# Altium schematic sheet 11.RK3588_MIPI_D_C_PHY0_1.SchDoc
size A3; SheetNumber: 11; SheetTotal: 21
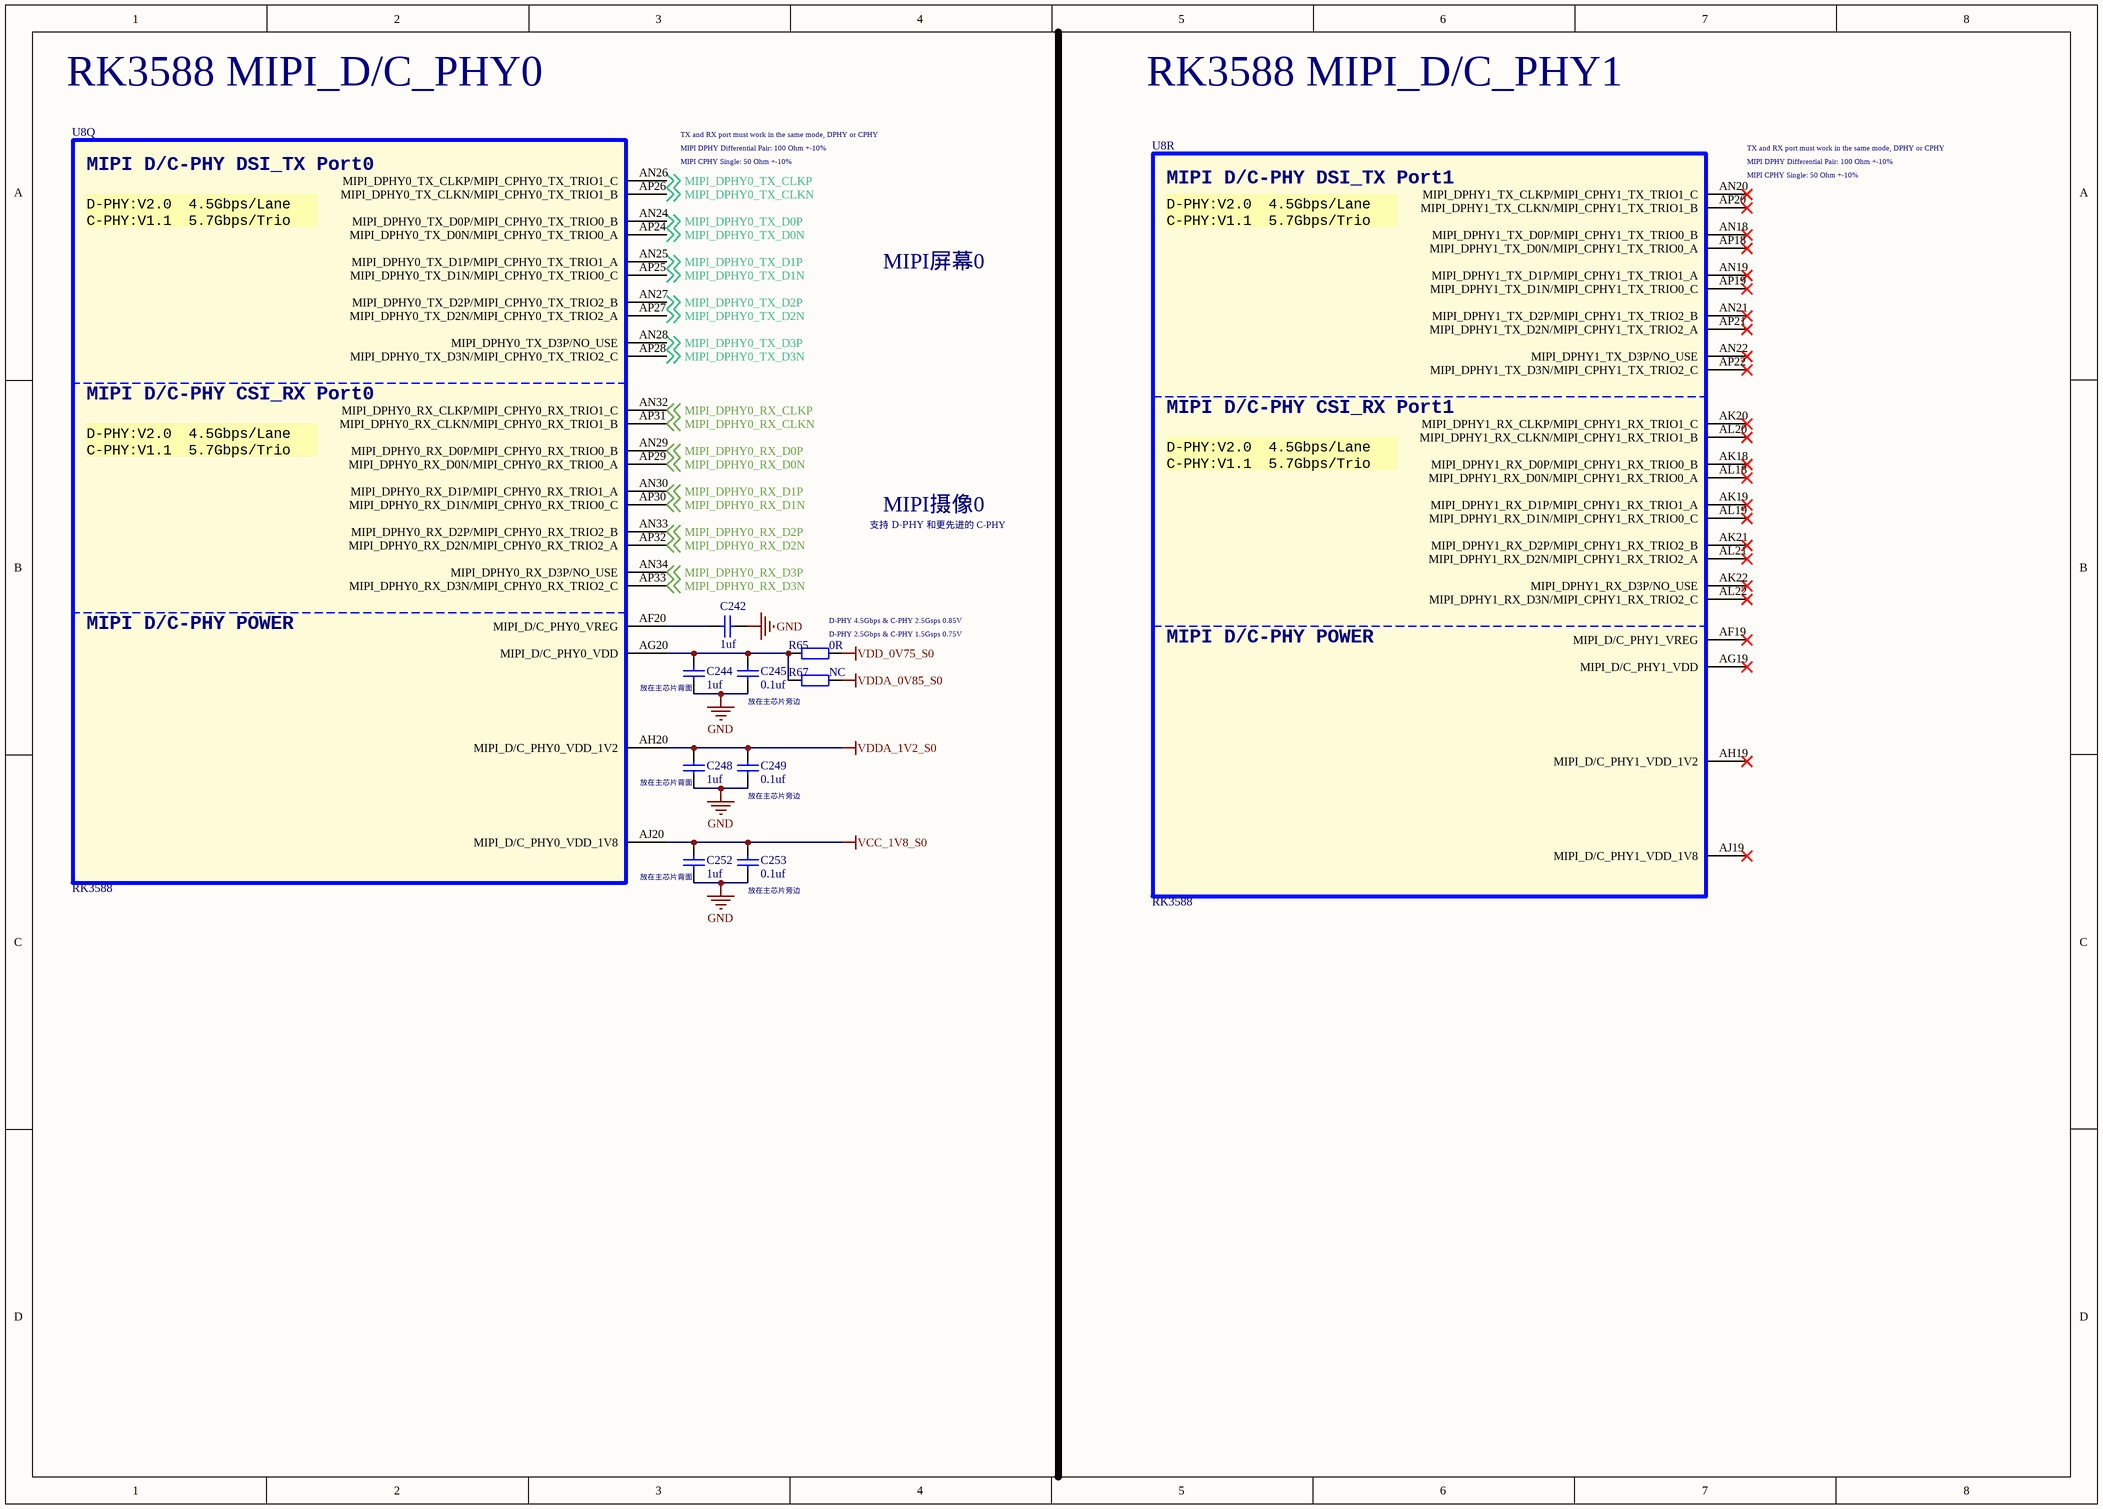
[diagram p0: 11.RK3588_MIPI_D_C_PHY0_1.SchDoc]

## Parts
C242  1uf  [C0201_L]
C244  1uf  [C0201_L]
C245  0.1uf  [C0201_L]
C248  1uf  [C0201_L]
C249  0.1uf  [C0201_L]
C252  1uf  [C0201_L]
C253  0.1uf  [C0201_L]
R65  0R  [R0402_L]
R67  NC  [R0402_L]
U8  RK3588  [BGA1088_23R00X23R00X2R00]  (parts Q,R of 26)

## Nets
GND: C242.2 C244.1 C245.1 C248.1 C249.1 C252.1 C253.1
VCC_1V8_S0: C252.2 C253.2 U8.AJ20(MIPI_D/C_PHY0_VDD_1V8)
VDD_0V75_S0: R65.2
VDDA_0V85_S0: R67.2
VDDA_1V2_S0: C248.2 C249.2 U8.AH20(MIPI_D/C_PHY0_VDD_1V2)
MIPI_DPHY0_RX_CLKN: U8.AP31(MIPI_DPHY0_RX_CLKN/MIPI_CPHY0_RX_TRIO1_B) ; off-sheet MIPI_DPHY0_RX_CLKN
MIPI_DPHY0_RX_CLKP: U8.AN32(MIPI_DPHY0_RX_CLKP/MIPI_CPHY0_RX_TRIO1_C) ; off-sheet MIPI_DPHY0_RX_CLKP
MIPI_DPHY0_RX_D0N: U8.AP29(MIPI_DPHY0_RX_D0N/MIPI_CPHY0_RX_TRIO0_A) ; off-sheet MIPI_DPHY0_RX_D0N
MIPI_DPHY0_RX_D0P: U8.AN29(MIPI_DPHY0_RX_D0P/MIPI_CPHY0_RX_TRIO0_B) ; off-sheet MIPI_DPHY0_RX_D0P
MIPI_DPHY0_RX_D1N: U8.AP30(MIPI_DPHY0_RX_D1N/MIPI_CPHY0_RX_TRIO0_C) ; off-sheet MIPI_DPHY0_RX_D1N
MIPI_DPHY0_RX_D1P: U8.AN30(MIPI_DPHY0_RX_D1P/MIPI_CPHY0_RX_TRIO1_A) ; off-sheet MIPI_DPHY0_RX_D1P
MIPI_DPHY0_RX_D2N: U8.AP32(MIPI_DPHY0_RX_D2N/MIPI_CPHY0_RX_TRIO2_A) ; off-sheet MIPI_DPHY0_RX_D2N
MIPI_DPHY0_RX_D2P: U8.AN33(MIPI_DPHY0_RX_D2P/MIPI_CPHY0_RX_TRIO2_B) ; off-sheet MIPI_DPHY0_RX_D2P
MIPI_DPHY0_RX_D3N: U8.AP33(MIPI_DPHY0_RX_D3N/MIPI_CPHY0_RX_TRIO2_C) ; off-sheet MIPI_DPHY0_RX_D3N
MIPI_DPHY0_RX_D3P: U8.AN34(MIPI_DPHY0_RX_D3P/NO_USE) ; off-sheet MIPI_DPHY0_RX_D3P
MIPI_DPHY0_TX_CLKN: U8.AP26(MIPI_DPHY0_TX_CLKN/MIPI_CPHY0_TX_TRIO1_B) ; off-sheet MIPI_DPHY0_TX_CLKN
MIPI_DPHY0_TX_CLKP: U8.AN26(MIPI_DPHY0_TX_CLKP/MIPI_CPHY0_TX_TRIO1_C) ; off-sheet MIPI_DPHY0_TX_CLKP
MIPI_DPHY0_TX_D0N: U8.AP24(MIPI_DPHY0_TX_D0N/MIPI_CPHY0_TX_TRIO0_A) ; off-sheet MIPI_DPHY0_TX_D0N
MIPI_DPHY0_TX_D0P: U8.AN24(MIPI_DPHY0_TX_D0P/MIPI_CPHY0_TX_TRIO0_B) ; off-sheet MIPI_DPHY0_TX_D0P
MIPI_DPHY0_TX_D1N: U8.AP25(MIPI_DPHY0_TX_D1N/MIPI_CPHY0_TX_TRIO0_C) ; off-sheet MIPI_DPHY0_TX_D1N
MIPI_DPHY0_TX_D1P: U8.AN25(MIPI_DPHY0_TX_D1P/MIPI_CPHY0_TX_TRIO1_A) ; off-sheet MIPI_DPHY0_TX_D1P
MIPI_DPHY0_TX_D2N: U8.AP27(MIPI_DPHY0_TX_D2N/MIPI_CPHY0_TX_TRIO2_A) ; off-sheet MIPI_DPHY0_TX_D2N
MIPI_DPHY0_TX_D2P: U8.AN27(MIPI_DPHY0_TX_D2P/MIPI_CPHY0_TX_TRIO2_B) ; off-sheet MIPI_DPHY0_TX_D2P
MIPI_DPHY0_TX_D3N: U8.AP28(MIPI_DPHY0_TX_D3N/MIPI_CPHY0_TX_TRIO2_C) ; off-sheet MIPI_DPHY0_TX_D3N
MIPI_DPHY0_TX_D3P: U8.AN28(MIPI_DPHY0_TX_D3P/NO_USE) ; off-sheet MIPI_DPHY0_TX_D3P
NetC242_1: C242.1 U8.AF20(MIPI_D/C_PHY0_VREG)
NetC244_2: C244.2 C245.2 R65.1 R67.1 U8.AG20(MIPI_D/C_PHY0_VDD)

Not connected (* = marked no-connect by the designer): U8 AF19(MIPI_D/C_PHY1_VREG)* AG19(MIPI_D/C_PHY1_VDD)* AH19(MIPI_D/C_PHY1_VDD_1V2)* AJ19(MIPI_D/C_PHY1_VDD_1V8)* AK18(MIPI_DPHY1_RX_D0P/MIPI_CPHY1_RX_TRIO0_B)* AK19(MIPI_DPHY1_RX_D1P/MIPI_CPHY1_RX_TRIO1_A)* AK20(MIPI_DPHY1_RX_CLKP/MIPI_CPHY1_RX_TRIO1_C)* AK21(MIPI_DPHY1_RX_D2P/MIPI_CPHY1_RX_TRIO2_B)* AK22(MIPI_DPHY1_RX_D3P/NO_USE)* AL18(MIPI_DPHY1_RX_D0N/MIPI_CPHY1_RX_TRIO0_A)* AL19(MIPI_DPHY1_RX_D1N/MIPI_CPHY1_RX_TRIO0_C)* AL20(MIPI_DPHY1_RX_CLKN/MIPI_CPHY1_RX_TRIO1_B)* AL21(MIPI_DPHY1_RX_D2N/MIPI_CPHY1_RX_TRIO2_A)* AL22(MIPI_DPHY1_RX_D3N/MIPI_CPHY1_RX_TRIO2_C)* AN18(MIPI_DPHY1_TX_D0P/MIPI_CPHY1_TX_TRIO0_B)* AN19(MIPI_DPHY1_TX_D1P/MIPI_CPHY1_TX_TRIO1_A)* AN20(MIPI_DPHY1_TX_CLKP/MIPI_CPHY1_TX_TRIO1_C)* AN21(MIPI_DPHY1_TX_D2P/MIPI_CPHY1_TX_TRIO2_B)* AN22(MIPI_DPHY1_TX_D3P/NO_USE)* AP18(MIPI_DPHY1_TX_D0N/MIPI_CPHY1_TX_TRIO0_A)* AP19(MIPI_DPHY1_TX_D1N/MIPI_CPHY1_TX_TRIO0_C)* AP20(MIPI_DPHY1_TX_CLKN/MIPI_CPHY1_TX_TRIO1_B)* AP21(MIPI_DPHY1_TX_D2N/MIPI_CPHY1_TX_TRIO2_A)* AP22(MIPI_DPHY1_TX_D3N/MIPI_CPHY1_TX_TRIO2_C)*

## Notes on the sheet
- RK3588 MIPI_D/C_PHY0
- RK3588 MIPI_D/C_PHY1
- TX and RX port must work in the same mode, DPHY or CPHY
- MIPI DPHY Differential Pair: 100 Ohm +-10%
- MIPI CPHY Single: 50 Ohm +-10%
- (near U8) MIPI DPHY Differential Pair: 100 Ohm +-10%
- (near U8) MIPI CPHY Single: 50 Ohm +-10%
- MIPI屏幕0
- MIPI摄像0
- 支持 D-PHY​ 和更先进的 C-PHY
- (near R65) D-PHY 4.5Gbps & C-PHY 2.5Gsps 0.85V
- (near R65) D-PHY 2.5Gbps & C-PHY 1.5Gsps 0.75V
- (near U8) 放在主芯片背面
- (near C245) 放在主芯片旁边
- (near C249) 放在主芯片旁边
- 放在主芯片背面
- (near C253) 放在主芯片旁边
- (in symbol SOC_RK3588, part Q) MIPI D/C-PHY DSI_TX Port0; D-PHY:V2.0  4.5Gbps/Lane / C-PHY:V1.1  5.7Gbps/Trio; MIPI D/C-PHY CSI_RX Port0; MIPI D/C-PHY POWER
- (in symbol SOC_RK3588, part R) MIPI D/C-PHY DSI_TX Port1; D-PHY:V2.0  4.5Gbps/Lane / C-PHY:V1.1  5.7Gbps/Trio; MIPI D/C-PHY CSI_RX Port1; MIPI D/C-PHY POWER

## Library data of the parts
C242 C244 C245 C248 C249 C252 C253 = C: 贴片电容/MLCC电容
R65 R67 = R: 贴片电阻
U8 = SOC_RK3588: ROCKCHIP SOC